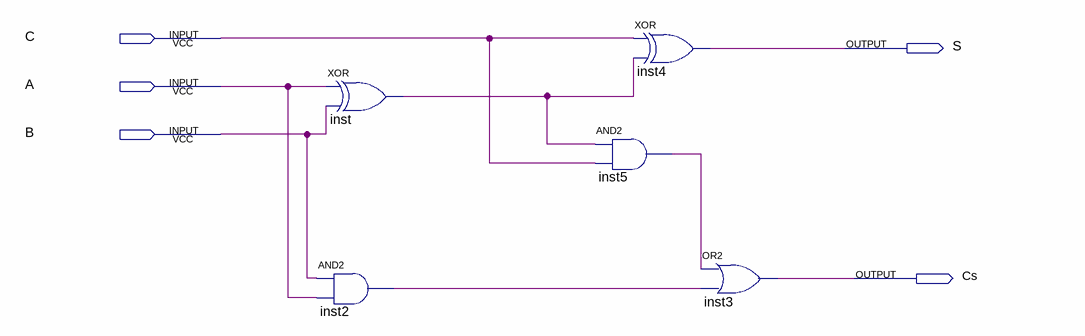
[diagram p0: schematic sheet]
// Quartus schematic soma.bdf as structural Verilog: 5 symbols, 5 pins
module soma (
  input  C,
  input  A,
  input  B,
  output S,
  output Cs
);

  wire inst2_out, inst5_out, inst_out;

  xor inst (inst_out, A, B);
  and inst2 (inst2_out, B, A);
  xor inst4 (S, C, inst_out);
  and inst5 (inst5_out, inst_out, C);
  or inst3 (Cs, inst5_out, inst2_out);
endmodule
